# EAGLE design pcb-breakout-skw71 (EAGLE 7.5.0)
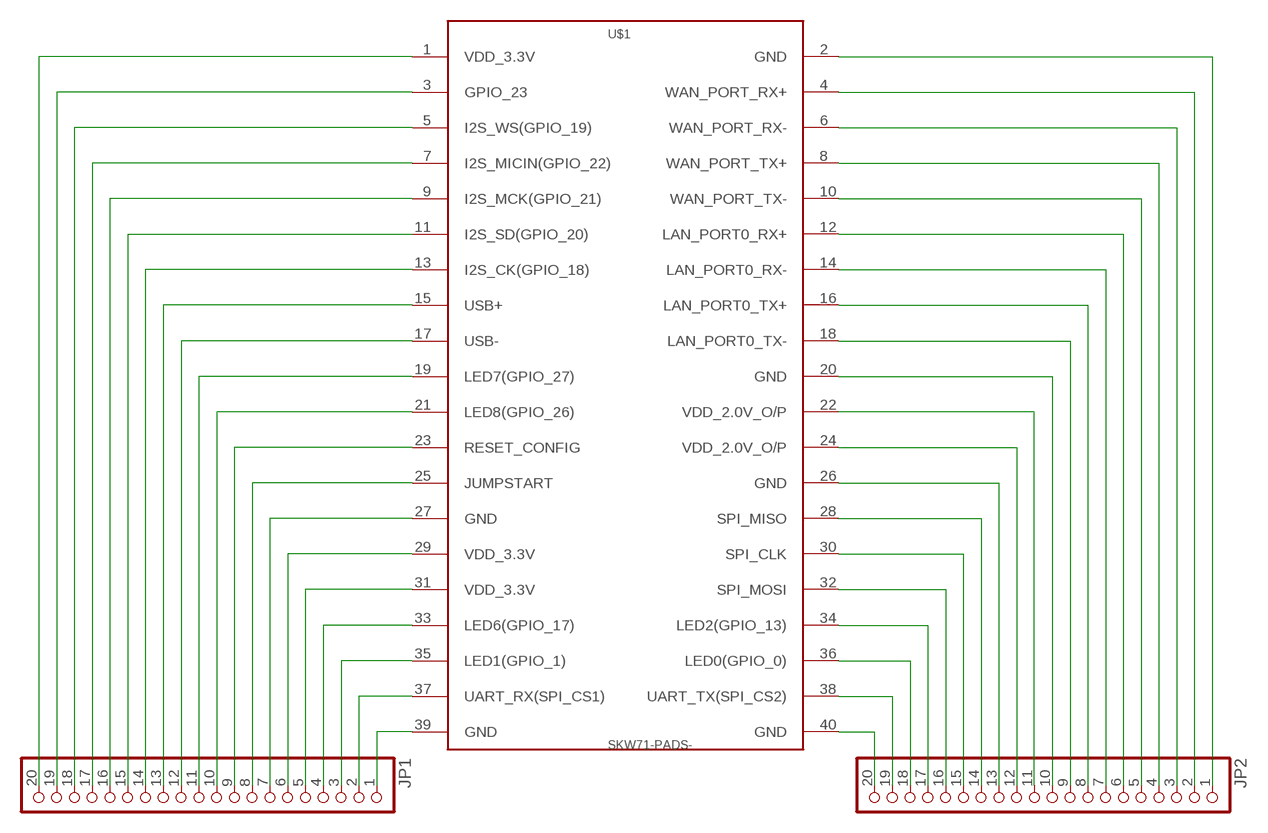
[diagram p0: schematic, sheet 1]

## Parts
JP1  PINHD-1X20  [1X20]
JP2  PINHD-1X20  [1X20]
U$1  SKW71-PADS-  [SKW71-SMT]

## Nets
N$1: JP1.20 U$1.1(VDD_3.3V)
N$2: JP2.1 U$1.2(GND)
N$3: JP1.18 U$1.5(I2S_WS(GPIO_19))
N$4: JP1.19 U$1.3(GPIO_23)
N$5: JP2.2 U$1.4(WAN_PORT_RX+)
N$6: JP1.17 U$1.7(I2S_MICIN(GPIO_22))
N$7: JP1.16 U$1.9(I2S_MCK(GPIO_21))
N$8: JP1.15 U$1.11(I2S_SD(GPIO_20))
N$9: JP1.14 U$1.13(I2S_CK(GPIO_18))
N$10: JP1.13 U$1.15(USB+)
N$11: JP1.12 U$1.17(USB-)
N$12: JP1.11 U$1.19(LED7(GPIO_27))
N$13: JP1.10 U$1.21(LED8(GPIO_26))
N$14: JP1.9 U$1.23(RESET_CONFIG)
N$15: JP1.8 U$1.25(JUMPSTART)
N$16: JP1.7 U$1.27(GND)
N$17: JP1.6 U$1.29(VDD_3.3V)
N$18: JP1.5 U$1.31(VDD_3.3V)
N$19: JP1.4 U$1.33(LED6(GPIO_17))
N$20: JP1.3 U$1.35(LED1(GPIO_1))
N$21: JP1.2 U$1.37(UART_RX(SPI_CS1))
N$22: JP1.1 U$1.39(GND)
N$23: JP2.3 U$1.6(WAN_PORT_RX-)
N$24: JP2.4 U$1.8(WAN_PORT_TX+)
N$25: JP2.5 U$1.10(WAN_PORT_TX-)
N$26: JP2.6 U$1.12(LAN_PORT0_RX+)
N$27: JP2.7 U$1.14(LAN_PORT0_RX-)
N$28: JP2.8 U$1.16(LAN_PORT0_TX+)
N$29: JP2.9 U$1.18(LAN_PORT0_TX-)
N$30: JP2.10 U$1.20(GND)
N$31: JP2.11 U$1.22(VDD_2.0V_O/P)
N$32: JP2.12 U$1.24(VDD_2.0V_O/P)
N$33: JP2.13 U$1.26(GND)
N$34: JP2.14 U$1.28(SPI_MISO)
N$35: JP2.15 U$1.30(SPI_CLK)
N$36: JP2.16 U$1.32(SPI_MOSI)
N$37: JP2.17 U$1.34(LED2(GPIO_13))
N$38: JP2.18 U$1.36(LED0(GPIO_0))
N$39: JP2.19 U$1.38(UART_TX(SPI_CS2))
N$40: JP2.20 U$1.40(GND)

## Library data of the parts
JP1 JP2 = pinhead:PINHD-1X20: PIN HEADER
U$1 = BaseApp:SKW71-PADS

## Board
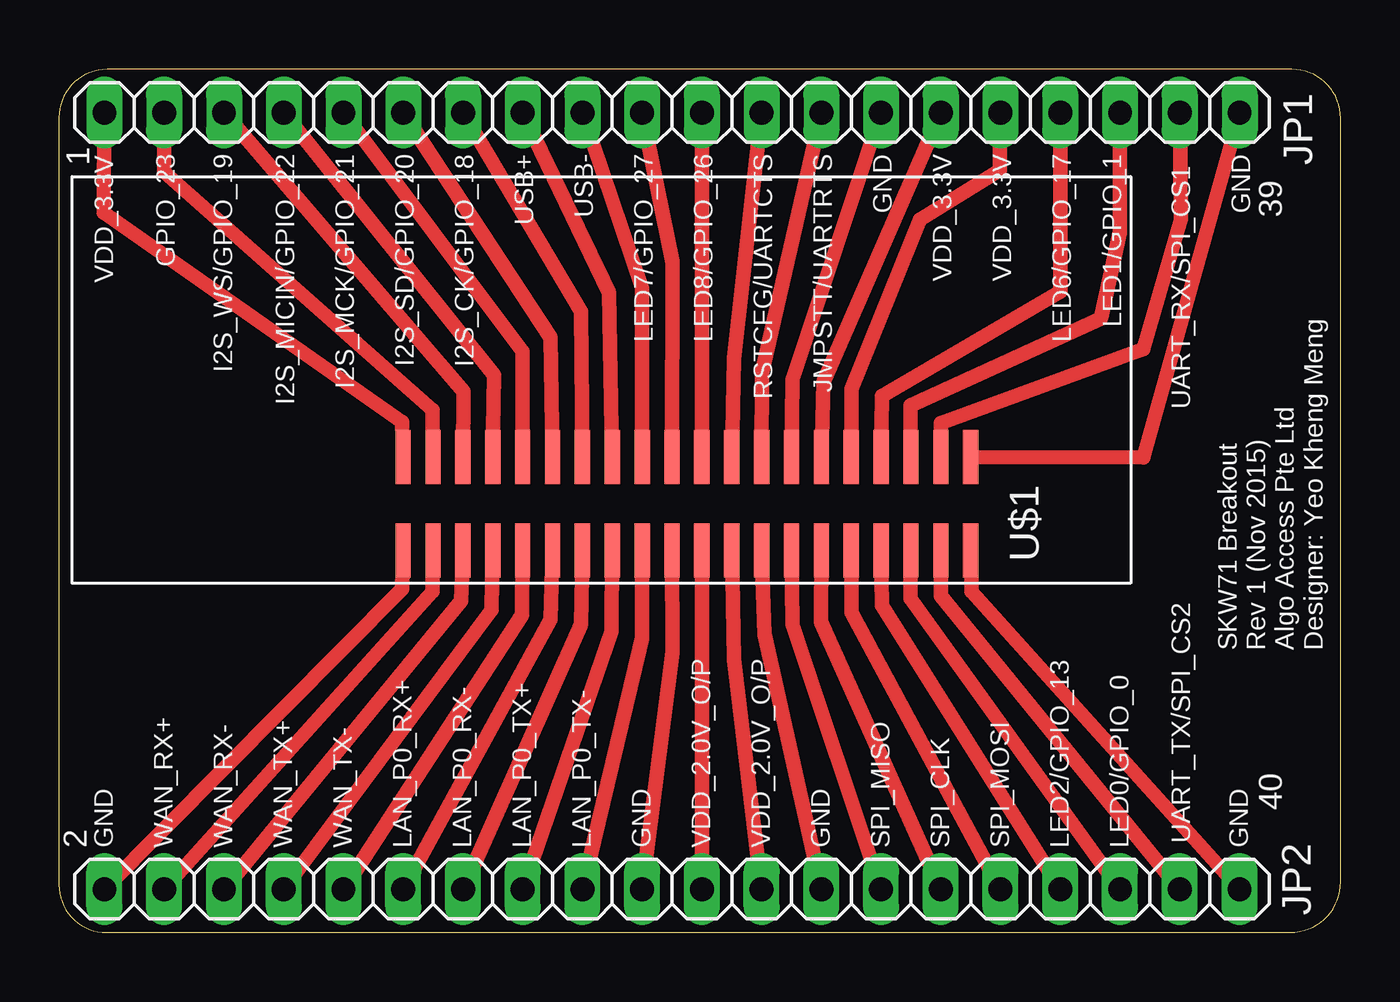
[diagram p1: board, top side]

Size 54.5 x 36.7 mm. Coordinates in mm from the lower left corner, seen from the top.
Outline: 2.02,0 52.36,0 arc90 54.5,2.14 54.5,34.62 arc90 52.42,36.7 2.06,36.7 arc90 0,34.64 0,2.02 arc90 2.02,0
Copper layers (1*16): Top 0.035mm / dielectric 1.5mm / Bottom 0.035mm
Design rules "Elecrow_2-layer_eagle_rule": minimum track width 6mil, minimum drill 12mil, track to track 6mil, track to pad 6mil, pad to pad 6mil, via to via 6mil, smd to smd 0mil, copper to edge 10mil, drill to drill 10mil, minimum pad ring 10mil, minimum via ring 6mil, stop-mask expansion 2mil, vias tented up to drill 100mil, thermal gap 10mil

### Footprints (pad centres in the part's own frame; a part is rotated, then mirrored left to right if it is on the bottom)
1X20 = drill 1.016 long: 1 -24.13,0; 2 -21.59,0; 3 -19.05,0; 4 -16.51,0; 5 -13.97,0; 6 -11.43,0; 7 -8.89,0; 8 -6.35,0; 9 -3.81,0; 10 -1.27,0; 11 1.27,0; 12 3.81,0; 13 6.35,0; 14 8.89,0; 15 11.43,0; 16 13.97,0; 17 16.51,0; 18 19.05,0; 19 21.59,0; 20 24.13,0
SKW71-SMT = smd 0.65 x 2.3: 1 0,-0.3; 2 0,3.685; 3 -1.27,-0.3; 4 -1.27,3.685; 5 -2.54,-0.3; 6 -2.54,3.685; 7 -3.81,-0.3; 8 -3.81,3.685; 9 -5.08,-0.3; 10 -5.08,3.685; 11 -6.35,-0.3; 12 -6.35,3.685; 13 -7.62,-0.3; 14 -7.62,3.685; 15 -8.89,-0.3; 16 -8.89,3.685; 17 -10.16,-0.3; 18 -10.16,3.685; 19 -11.43,-0.3; 20 -11.43,3.685; 21 -12.7,-0.3; 22 -12.7,3.685; 23 -13.97,-0.3; 24 -13.97,3.685; 25 -15.24,-0.3; 26 -15.24,3.685; 27 -16.51,-0.3; 28 -16.51,3.685; 29 -17.78,-0.3; 30 -17.78,3.685; 31 -19.05,-0.3; 32 -19.05,3.685; 33 -20.32,-0.3; 34 -20.32,3.685; 35 -21.59,-0.3; 36 -21.59,3.685; 37 -22.86,-0.3; 38 -22.86,3.685; 39 -24.13,-0.3; 40 -24.13,3.685

### Placement (x,y rotation side)
JP1  26.07,34.86 180 top
JP2  26.07,1.84 0 top
U$1  14.64,19.92 180 top

### Tracks (layer width: path | path; a pad name or v marks a point on that pad's centre or on a via)
N$1
  Top 0.61: U$1.1 14.6,21.7 1.9,30.6 JP1.20
N$2
  Top 0.61: U$1.2 14.6,14.6 JP2.1
N$3
  Top 0.61: U$1.5 17.2,23 JP1.18
N$4
  Top 0.61: U$1.3 15.9,22.2 4.48,32.32 JP1.19
N$5
  Top 0.61: U$1.4 15.9,14.5 JP2.2
N$6
  Top 0.61: JP1.17 18.5,23.7 U$1.7
N$7
  Top 0.61: U$1.9 19.72,24.7 JP1.16
N$8
  Top 0.61: U$1.11 20.9,25.3 JP1.15
N$9
  Top 0.61: U$1.13 22.2,26.4 JP1.14
N$10
  Top 0.61: U$1.15 23.4,27.2 JP1.13
N$11
  Top 0.61: U$1.17 24.8,27.4 JP1.12
N$12
  Top 0.61: U$1.19 26.1,28.5 JP1.11
N$13
  Top 0.61: U$1.21 JP1.10
N$14
  Top 0.61: U$1.23 28.7,24.4 JP1.9
N$15
  Top 0.61: U$1.25 29.9,23.8 JP1.8
N$16
  Top 0.61: U$1.27 31.2,23.5 JP1.7
N$17
  Top 0.61: U$1.29 32.5,23.4 JP1.6
N$18
  Top 0.61: U$1.31 33.7,23.1 36.6,30.3 40,32.4 JP1.5
N$19
  Top 0.61: U$1.33 35,22.8 42.58,27.24 JP1.4
N$20
  Top 0.61: U$1.35 36.2,22.4 44.3,26.1 45.12,29.78 JP1.3
N$21
  Top 0.61: U$1.37 37.5,21.66 46.1,24.8 47.7,30.3 JP1.2
N$22
  Top 0.61: U$1.39 46.1,20.2 JP1.1
N$23
  Top 0.61: U$1.6 17.1,14.1 JP2.3
N$24
  Top 0.61: U$1.8 18.4,13.7 JP2.4
N$25
  Top 0.61: U$1.10 19.7,13.5 JP2.5
N$26
  Top 0.61: U$1.12 20.9,13.3 JP2.6
N$27
  Top 0.61: U$1.14 22.2,13.1 JP2.7
N$28
  Top 0.61: U$1.16 23.5,12.8 JP2.8
N$29
  Top 0.61: U$1.18 24.8,12.5 JP2.9
N$30
  Top 0.61: U$1.20 26.1,11.9 JP2.10
N$31
  Top 0.61: U$1.22 JP2.11
N$32
  Top 0.61: U$1.24 28.7,11.6 JP2.12
N$33
  Top 0.61: U$1.26 30,12.7 JP2.13
N$34
  Top 0.61: U$1.28 31.2,13.1 JP2.14
N$35
  Top 0.61: U$1.30 32.4,13.2 JP2.15
N$36
  Top 0.61: U$1.32 33.7,13.6 JP2.16
N$37
  Top 0.61: U$1.34 35,13.9 JP2.17
N$38
  Top 0.61: U$1.36 36.2,14.2 JP2.18
N$39
  Top 0.61: U$1.38 37.5,14.3 JP2.19
N$40
  Top 0.61: U$1.40 38.8,14.5 JP2.20

### Text on the board
tPlace: 1 | VDD_3.3V | GPIO_23 | I2S_WS/GPIO_19 | I2S_MICIN/GPIO_22 | I2S_MCK/GPIO_21 | I2S_SD/GPIO_20 | I2S_CK/GPIO_18 | USB+ | USB- | LED7/GPIO_27 | LED8/GPIO_26 | RSTCFG/UARTCTS | JMPSTT/UARTRTS | GND | VDD_3.3V | VDD_3.3V | LED6/GPIO_17 | LED1/GPIO_1 | GND | 39 | UART_RX/SPI_CS1 | SKW71 Breakout / Rev 1 (Nov 2015) / Algo Access Pte Ltd / Designer: Yeo Kheng Meng | 40 | 2 | GND | WAN_RX+ | WAN_RX- | WAN_TX+ | WAN_TX- | LAN_P0_RX+ | LAN_P0_RX- | LAN_P0_TX+ | LAN_P0_TX- | GND | VDD_2.0V_O/P | VDD_2.0V_O/P | GND | SPI_MISO | SPI_CLK | SPI_MOSI | LED2/GPIO_13 | LED0/GPIO_0 | UART_TX/SPI_CS2 | GND